# Altium project spoofer_v1.PrjPcb
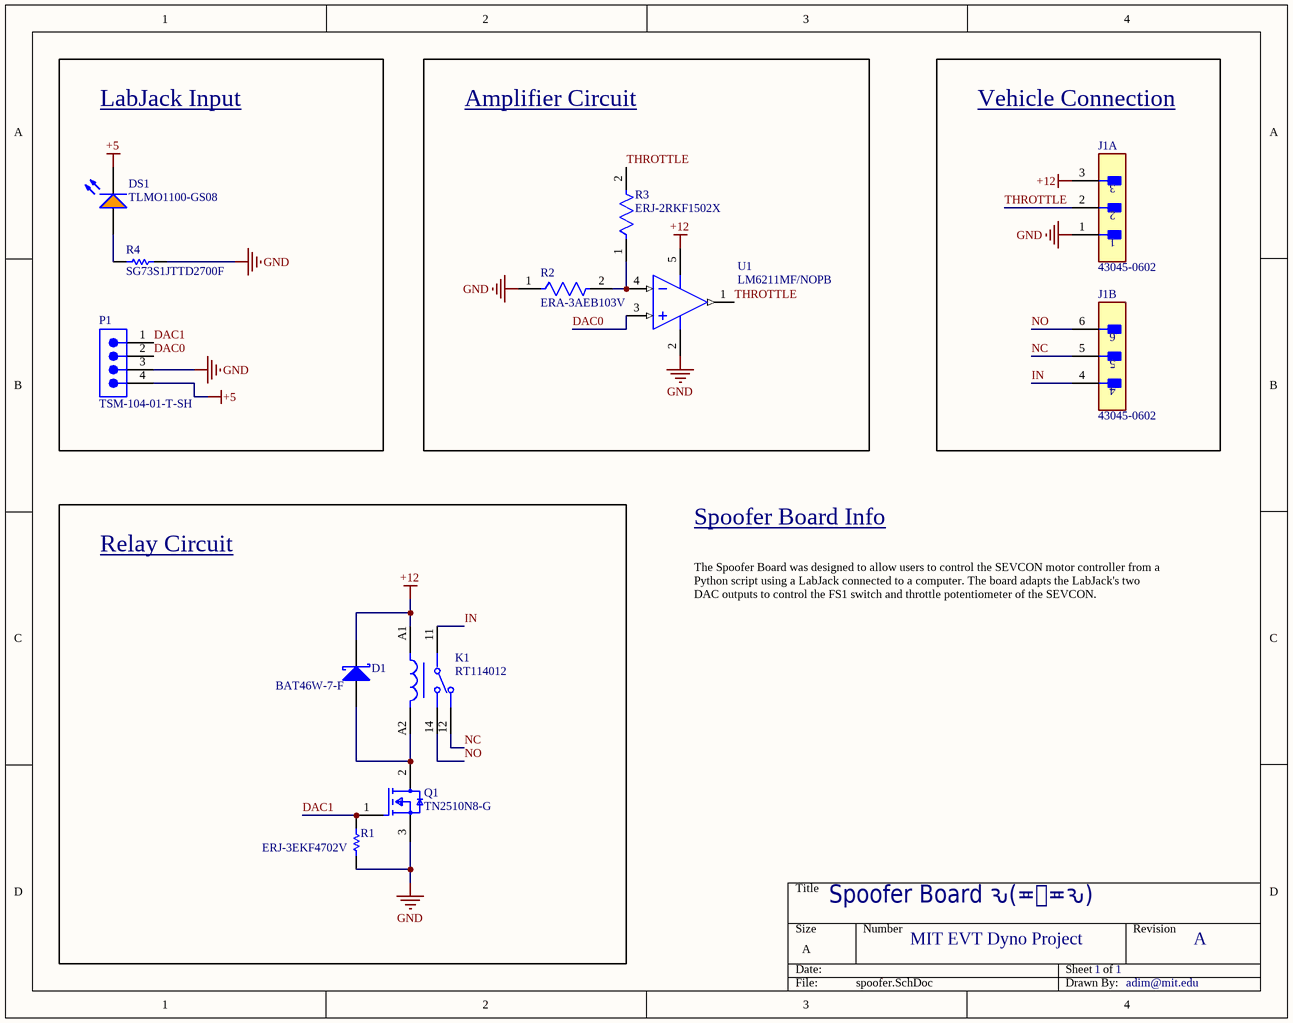
[diagram p0: spoofer.SchDoc]
1 sheet, 11 parts. Net scope: global (net labels, ports and power ports of the same name join across sheets).
Board file: spoofer.PcbDoc

## Sheet spoofer.SchDoc
size A; SheetNumber: 1; SheetTotal: 1

### Parts
D1  BAT46W-7-F  [DIOD-SOD-123-2_V]
DS1  TLMO1100-GS08  [VISH-TLMX1100-2_V]
J1  43045-0602  [FP-43045-0602-MFG]  (parts A,B of 2)
K1  RT114012  [FP-RT114012-MFG]
P1  TSM-104-01-T-SH  [SMTC-TSM-104-01-X-SH]
Q1  TN2510N8-G  [FP-TN2510N8-G-IPC_C]
R1  ERJ-3EKF4702V  [RESC1608X55X30NL15T15]
R2  ERA-3AEB103V  [FP-ERA3A-IPC_C]
R3  ERJ-2RKF1502X  [FP-ERJ2R-MFG]
R4  SG73S1JTTD2700F  [RESC1608X55X30ML20T10]
U1  LM6211MF/NOPB  [DBV0005A_L]

### Blocks framed on the sheet
LabJack Input: DS1 P1 R4
Amplifier Circuit: R2 R3 U1
Vehicle Connection: J1
Relay Circuit: D1 K1 Q1 R1

### Nets
+5: DS1.2(K) P1.4
+12: D1.2(K) J1.3 K1.A1 U1.5(V+)
GND: J1.1 P1.3 Q1.3(SOURCE) R1.1 R2.1 R4.2 U1.2(V-)
DAC0: P1.2 U1.3(IN+)
DAC1: P1.1 Q1.1(GATE) R1.2
IN: J1.4 K1.11
NC: J1.5 K1.12
NO: J1.6 K1.14
THROTTLE: J1.2 R3.2 U1.1(VOUT)
NetD1_1: D1.1(A) K1.A2 Q1.2(DRAIN)
NetDS1_1: DS1.1(A) R4.1
NetR2_2: R2.2 R3.1 U1.4(IN-)

### Notes on the sheet
- Spoofer Board Info
- The Spoofer Board was designed to allow users to control the SEVCON motor controller from a Python script using a LabJack connected to a computer. The board adapts the LabJack's two DAC outputs to control the FS1 switch and throttle potentiometer of the SEVCON.
- Spoofer Board ԅ(≖⌣≖ԅ)
- MIT EVT Dyno Project
- 1
- A
- adim@mit.edu

### Library data of the parts
D1 = CMP-0303-00004-1: Surface Mount Schottky Barrier Diode, 100 V, -55 to 125 degC, 2-Pin SOD123, RoHS, Tape and Reel; Manufacturer: Diodes Inc; IR@1.5 V: 0.3 uA Max.; V(BR)R: 100 V Min.; VF@10 mA: 0.45 V Max.; CT@1 V: 12 pF Typ.; PartNumber: BAT46W-7-F; ComponentLink1URL: http://www.diodes.com/; ComponentLink3URL: http://diodes.com/datasheets/ds30044.pdf; PackageDescription: 2-Pin SMD, Body 2.7 x 1.55 mm, Height 1.45 mm; ComponentLink2Description: Datasheet; ComponentLink3Description: Package Specification; Mounting Technology: Surface Mount; ComponentLink1Description: Manufacturer URL; RoHS: TRUE; Operating Temperature: -55 to 125 degC; Packing: Tape and Reel; ComponentLink2URL: http://diodes.com/datasheets/ds30044.pdf; DatasheetVersion: Rev. 16-2
DS1 = CMP-1666-00029-1: Orange LED, 20 mA, 2.1 V, -40 to 100 degC, 2-Pin SMD (0603), RoHS, Tape and Reel; Forward Voltage: 1 V; Forward Current: 150 mA; Capacitance: -323 f; Recovery Time: 4 ns; Peak Reverse Current: 5 uA; ComponentLink1URL: http://www.vishay.com/; Width: 1.35 mm; PackageReference: 0603; Min Operating Temperature: -55 degC; Packaging: Tape and Reel; RoHSCompliant: true; ComponentLink2Description: Datasheet; PackageDescription: 2-Pin Surface Mount Device, Body 1.6 x 0.8 mm; DatasheetVersion: Rev. 2.7, 03/2016; Pins: 2; Max Operating Temperature: 150 degC; Radiation Hardening: No; Package Quantity: 3000; ComponentLink1Description: Manufacturer URL; Mount: Surface Mount; REACH SVHC: No SVHC; Length: 1.8 mm; ComponentLink2URL: http://download.siliconexpert.com/pdfs/2016/8/7/12/43/26/667/vsh_/manual/379263299541529tlmb1100.pdf; Height: 1 mm
J1 = CMP-04776-000581-1: CONN HEADER R/A 6POS 3MM; Insulation Resistance: 1GR; Current Rating: 5A; Voltage Rating (DC): 250V; Glow Wire Compliant: Compliant; Gender: Male; Number of Circuits: 6; Contact Resistance: 10mR; Max Voltage Rating (DC): 250.25kV; Housing Color: Black; Housing Material: Polymer; Number of Rows: 2; Max Operating Temperature: 105°C; Max Voltage Rating (AC): 250V; Orientation: Right Angle; Radiation Hardening: No; Mount: Through Hole; Connector Type: Header; Pitch: 3mm; Package Quantity: 1728; Voltage Rating: 250V; Series: Micro-Fit 3.0; Insulation Material: Polymer; Packaging: Tray; Min Operating Temperature: -40°C; Flammability Rating: UL94 V-0; Contact Material: Brass; Insulation Color: Black; Row Spacing: 3mm; Contact Plating: Gold; Number of Contacts: 6; Length: 13.15mm; Lead Free: Lead Free; Height: 8.77mm; Diameter: 3mm; Max Current Rating: 5A; Halogen Free: Low Halogen; Depth: 12.2mm; Contact Finish - Mating: GOLD; Fastening Type: Ramp; Color: Black; Termination: Solder; Contact Type: Male Pin; Contact Shape: Square; Number of Positions: 6; RoHS Compliant: Yes
K1 = CMP-03395-000068-1: RELAY GEN PURPOSE SPDT 12A 12V; Manufacturer: TE Connectivity; Coil Power: 400mW; Coil Resistance: 360Ω; Coil Type: Non-Latching; Number Of Contacts: 1; Height: 15.7mm; Throw Configuration: SPDT; Mouser Description: General Purpose Relays RT114012; Device Class L1: Electromechanical; ComponentLink2URL: https://www.te.com/commerce/DocumentDelivery/DDEController?Action=showdoc&DocId=Data+Sheet%7FRT1%7F0219%7Fpdf%7FEnglish%7FENG_DS_RT1_0219.pdf%7F1419108-1; Digikey Description: RELAY GEN PURPOSE SPDT 12A 12V; Package: RT114012; RoHS: TRUE; ComponentLink2Description: Datasheet; Octopart: https://octopart.com/rt114012-te+connectivity-39636422; Device Class L2: Relays; Manufacturer Part Number: RT114012; Ambient Temperature Range High: +85°C; Ambient Temperature Range Low: -40°C; Coil Voltage: 12V; Current Rating: 12A; Category: Relay; Lead Free: Yes; Device Class L3: Power Relays; Automotive: No
P1 = CMP-1024-00223-1: 0.025" SQ Post Header, Surface Mount, Horizontal, -55 to 105 degC, 2.54 mm Pitch, 4-Pin, Male, RoHS; Manufacturer: Samtec; Pitch: 2.54 mm; ComponentLink1URL: http://www.samtec.com; ComponentLink3URL: http://www.samtec.com/documents/webfiles/cpdf/TSM-1XX-XX-XXX-SH-XX-XXX-XX-MKT1.pdf; Temperature Range: -55 to 105 degC; Orientation: Horizontal; ComponentLink1Description: Manufacturer URL; PackageReference: TSM-104-01-X-SH; PackageDescription: Terminal Strip Single Surface Mount; ComponentLink2Description: Datasheet; ComponentLink2URL: http://www.samtec.com/documents/webfiles/pdf/TSM.PDF; RoHS: True; ComponentLink3Description: Package Specification; Mounting Technology: Surface Mount; PackageVersion: CD, 7/1991; PartNumber: TSM-104-01-T-SH; DatasheetVersion: F-214
Q1 = CMP-06369-000016-1: MOSFET N-CH 100V 730MA TO243AA; Turn-On Delay Time: 10ns; Max Power Dissipation: 1.6W; Gate to Source Voltage (Vgs): 20V; Input Capacitance: 125pF; Element Configuration: Single; Drain to Source Resistance: 1.5R; Turn-Off Delay Time: 20ns; Number of Elements: 1; Polarity: N-CHANNEL; Length: 4.6mm; Packaging: Tape and Reel; Case/Package: TO-243AA; Series: -; Number of Pins: 4; Mount: Surface Mount; Contact Plating: Tin; Package Quantity: 2000; Min Operating Temperature: -55°C; Radiation Hardening: No; Lead Free: Lead Free; Height: 1.6mm; Width: 2.6mm; Weight: 0.001862oz; Rds On Max: 1.5R; Power Dissipation: 1.6W; Drain to Source Breakdown Voltage: 100V; Rise Time: 10ns; Fall Time: 10ns; Continuous Drain Current (ID): 730mA; Max Operating Temperature: 150°C; Number of Channels: 1
R1 = CMP-2000-00523-2: Chip Resistor, 47 KOhm, +/- 1%, 0.1 W, -55 to 155 degC, 0603 (1608 Metric), RoHS, Tape and Reel; Case\Package: 0603; Forward Current: 20 mA; Power Rating: 90 mW; Illumination Colour: Red; Nominal Vf: 2.1 V; Viewing Angle: 160 degrees; Luminous Intensity: 63 mcd; Lens Style: Clear; Nominal Wavelength: 639 nm; Case Code (Imperial): 0603; Case Code (Metric): 1608; Packaging: Tape and Reel; Radiation Hardening: No; Colour: Red; PackageDescription: 2-Pin Surface Mount Device, Body 1.6 x 0.85 mm; ComponentLink1Description: Manufacturer URL; Width: 0.8 mm; DatasheetVersion: Apr-15; ComponentLink2URL: http://industrial.panasonic.com/cdbs/www-data/pdf/RDA0000/AOA0000C86.pdf; Min Operating Temperature: -40 degC; Height: 0.6 mm; Package Quantity: 3000; ComponentLink2Description: Datasheet; REACH SVHC: No SVHC; ComponentLink1URL: http://www.panasonic.com/; Mount: Surface Mount; RoHSCompliant: true; Max Operating Temperature: 100 degC; PackageReference: 0603; Length: 1.6 mm; Forward Voltage: 2.1 V; Pins: 2
R2 = CMP-2000-00874-2: RES SMD 10K OHM 0.1% 1/10W 0603; Voltage Rating (DC): 75V; Power Rating: 100mW; Resistance: 10kR; Temperature Coefficient: 25ppm/°C; Radiation Hardening: No; Width: 0.8mm; Depth: 0.8mm; Construction: Rectangular; Case Code (Metric): 1608; Package Quantity: 5000; Length: 1.6mm; Size Code: 0603; Case Code (Imperial): 0603; Termination: SMD/SMT; Contact Plating: Tin; Resistance Tolerance: 0.1%; Military Standard: Not; Packaging: Tape and Reel; Max Power Dissipation: 100mW; REACH SVHC: No SVHC; Series: ERA-3A; Voltage Rating: 75V; Lead Free: Lead Free; Technology: METAL FILM; RoHS Compliant: Yes; Max Operating Temperature: 155°C; Resistor Type: Thin Film; Min Operating Temperature: -55°C; Number of Pins: 2; Case/Package: 0603; Tolerance: 0.1%; Height: 0.45mm; Mount: Surface Mount; Number of Terminations: 2
R3 = CMP-2002-00694-4: RES SMD 15K OHM 1% 1/10W 0402; Manufacturer: Panasonic; Automotive Grade: Grade 0; Voltage Rating: 50V; Resistance: 15kΩ; Temperature Coefficient: 100ppm/°C; Power Rating: 0.1W; Value: 15kΩ; ComponentLink2URL: https://industrial.panasonic.com/cdbs/www-data/pdf/RDA0000/AOA0000C304.pdf; Automotive: Yes; Temperature: -55°C to +155°C; Height: 0.4mm; Digikey Description: RES SMD 15K OHM 1% 1/10W 0402; Category: Res; Device Class L2: Resistors; Device Class L1: Passive Components; Package: ERJ2R; Temperature Range Low: -55°C; Tolerance: 1%; Series: ERJ; Manufacturer Part Number: ERJ-2RKF1502X; Footprint Url: https://b2b-api.panasonic.eu/file_stream/pids/fileversion/1180; Mouser Description: Res Thick Film 1.0 x 0.5 mm 15K Ohm 1% 0.1W(1/10W) 100ppm/ C Molded SMD Punched Carrier T/R; Composition: Thick Film; Lead Free: Yes; Device Class L3: Chip SMD Resistors; Octopart: https://octopart.com/erj-2rkf1502x-panasonic-55404985; RoHS: TRUE; Temperature Range High: +155°C; ComponentLink2Description: Datasheet
R4 = CMP-2000-01816-1: Manufacturer: KOA Speer; Part Number: SG73S1JTTD2700F
U1 = CMP-0055-01295-3: Low Noise, RRO Operational Amplifier with CMOS Input and 24V Operation, 5-pin SOT-23, Pb-Free; Manufacturer: Texas Instruments; PackageTopMarking: AT1A*XTT; CompType: Amplifiers; PowerWise: Y; ComponentLink1URL: http://www.ti.com/general/docs/lit/getliterature.tsp?genericPartNumber=LM6211&fileType=pdf; ComponentLink1Description: Datasheet URL; RoHS: Y; Package Reference: DBV0005A; PinCount: 5; PackageDescription: Molded SOT-23, .115 x .063 x .040 in Body, 5 Lead, .0375 in Pitch